# Altium schematic sheet CustomTP4056Module.SchDoc
size A; SheetNumber: 1; SheetTotal: 1
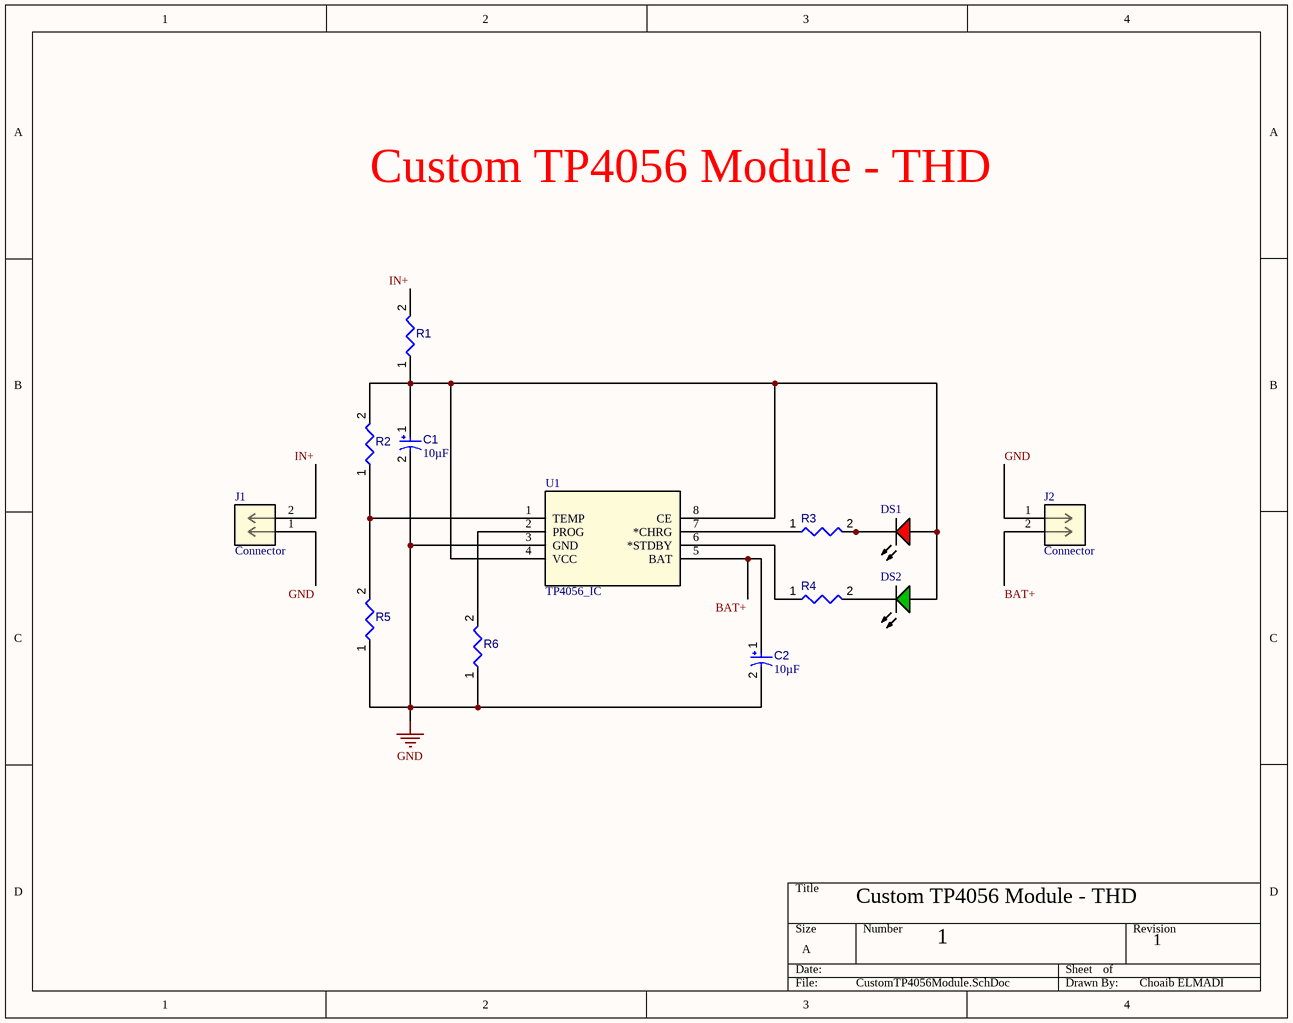
[diagram p0: CustomTP4056Module.SchDoc]

## Parts
C1  value 10µF  [CAPPR55-200-1100X500X1200]  (hidden comment: ECA1HM100)
C2  value 10µF  [CAPPR55-200-1100X500X1200]  (hidden comment: ECA1HM100)
DS1  LTL-1CHE  [INDPR60-254-520X380X650]  (value not drawn)
DS2  LTL-1CHG  [LTST-LTL-1CHG-2]  (value not drawn)
J1  Connector  [CONN_M20-99902_HRW]
J2  Connector  [CONN_M20-99902_HRW]
R1  MFR-25FBF52-475R  [RESA60-630X240]  (value not drawn)
R2  MFR-25FBF52-475R  [RESA60-630X240]  (value not drawn)
R3  MFR-25FBF52-475R  [RESA60-630X240]  (value not drawn)
R4  MFR-25FBF52-475R  [RESA60-630X240]  (value not drawn)
R5  MFR-25FBF52-475R  [RESA60-630X240]  (value not drawn)
R6  MFR-25FBF52-475R  [RESA60-630X240]  (value not drawn)
U1  TP4056_IC  [DIP-8_STM]

## Nets
GND: C1.2 C2.2 J1.1 J2.1 R5.1 R6.1 U1.3(GND)
BAT+: C2.1 J2.2 U1.5(BAT)
IN+: J1.2 R1.2
NetC1_1: C1.1 DS1.1(A) DS2.1(A) R1.1 R2.2 U1.4(VCC) U1.8(CE)
NetDS1_2: DS1.2(K) R3.2
NetDS2_2: DS2.2(K) R4.2
NetR2_1: R2.1 R5.2 U1.1(TEMP)
NetR3_1: R3.1 U1.7(*CHRG)
NetR4_1: R4.1 U1.6(*STDBY)
NetR6_2: R6.2 U1.2(PROG)

## Notes on the sheet
- Custom TP4056 Module - THD
- 1
- Choaib ELMADI

## Library data of the parts
C1 C2 = CMP-001-00025-7: Aluminum Electrolytic Capacitor, 10 uF, +/- 20%, 50 V, -40 to 85 degC, 2-Pin THD, RoHS, Bulk; Manufacturer: Panasonic; Ripple Current (AC): 65mA; Voltage Rating: 50V; Mounting Technology: TH; RoHS Compliant: True; Capacitor Type: Electrolytic; Datasheet Version: Rev. 05, 10/2016; Min Operating Temperature: -40°C; Packaging: Bulk; Ripple Current: 65mA; Tolerance: 20%; Max Operating Temperature: 85°C; Datasheet URL: https://industrial.panasonic.com/cdbs/www-data/pdf/RDF0000/ABA0000C1218.pdf; Lead Pitch: 2mm; Pins: 2; Diameter: 5mm; Manufacturer URL: http://www.panasonic.com/; Package Reference: CAPPR55-200-1100X500X1200; Package Description: 2-Pin Radial Lead, Dia 5 mm, Height 12 mm; Case/Package: Radial; Package Quantity: 200
DS1 = CMP-007-00018-2: LED Uni-Color Red, 100 mW, 30 mA, -55 to 100 degC, 2-Pin THD, RoHS, Bulk; Manufacturer: Lite-On; Forward Current: 20mA; Nominal Vf: 2V; Viewing Angle: 60degrees; Luminous Intensity: 12.6mcd; Lens Style: Dome; Pins: 2; RoHS Compliant: True; Package Reference: LTL-1CHE; Package Quantity: 1000; Mounting Technology: TH; Min Operating Temperature: -55°C; Colour: Red; Case/Package: Radial; Manufacturer URL: http://www.us.liteon.com/; Datasheet URL: https://datasheet.ciiva.com/15117/getdatasheetpartid-187746-15117985.pdf; Forward Voltage: 2V; Max Operating Temperature: 100°C; Illumination Colour: Red; Package Description: 2-Pin Through Hole Device, Dia 3.8 mm, Pitch 2.54 mm; Packaging: Bulk; Datasheet Version: Dec-03
DS2 = CMP-007-00019-2: LED Uni-Color Green, 100 mW, 30 mA, -55 to 100 degC, 2-Pin THD, RoHS, Bulk; Manufacturer: Lite-On; Power: 100mW; Forward Voltage: 2.6V; Forward Current: 30mA; Nominal Vf: 2.1V; Lens Style: Dome; Viewing Angle: 60degrees; Luminous Intensity: 12.6mcd; Max Operating Temperature: 100°C; Case/Package: Radial; Package Reference: LTL-1CHG; Manufacturer URL: http://www.us.liteon.com/; Package Quantity: 1000; Colour: Green; Packaging: Bulk; RoHS Compliant: True; Datasheet URL: http://datasheet.octopart.com/LTL-1CHG-Lite-On-datasheet-143841.pdf; Package Description: 2-Pin Through Hole Device, Dia 3.8 mm; Min Operating Temperature: -55°C; Mounting Technology: TH; Pins: 2; Illumination Colour: Green; Datasheet Version: Mar-00
J1 J2 = M20-9990245: No Description Available; Mfr_Name: Harwin; RefDes: RefDes; Type: Type
R1-R6 = CMP-009-00056-4: Axial Resistor, 220 Ohm, +/- 1%, 0.25 W, -55 to 155 degC, 2-Pin THD, RoHS, Bulk; Manufacturer: Yageo; Voltage Rating: 250V; Power: 250mW; Value: 220; Case/Package: Axial; Datasheet URL: http://www.yageo.com/documents/recent/Yageo%20LR_MFR_2013.pdf; Tolerance: 1%; RoHS Compliant: True; Mounting Technology: TH; Packaging: Bulk; Package Description: 2-Pin Axial Lead, Dia 2.4 mm, Body Length 6.3 mm; Max Operating Temperature: 155°C; Package Reference: MFR-25; Datasheet Version: Apr-13; Min Operating Temperature: -55°C; Package Quantity: 200; Manufacturer URL: http://www.yageo.com/
U1 = NE555N: No Description Available; Mfr_Name: STMicroelectronics; RefDes: RefDes; Type: Type